# Altium project Minuterie_teluq.PrjPcb
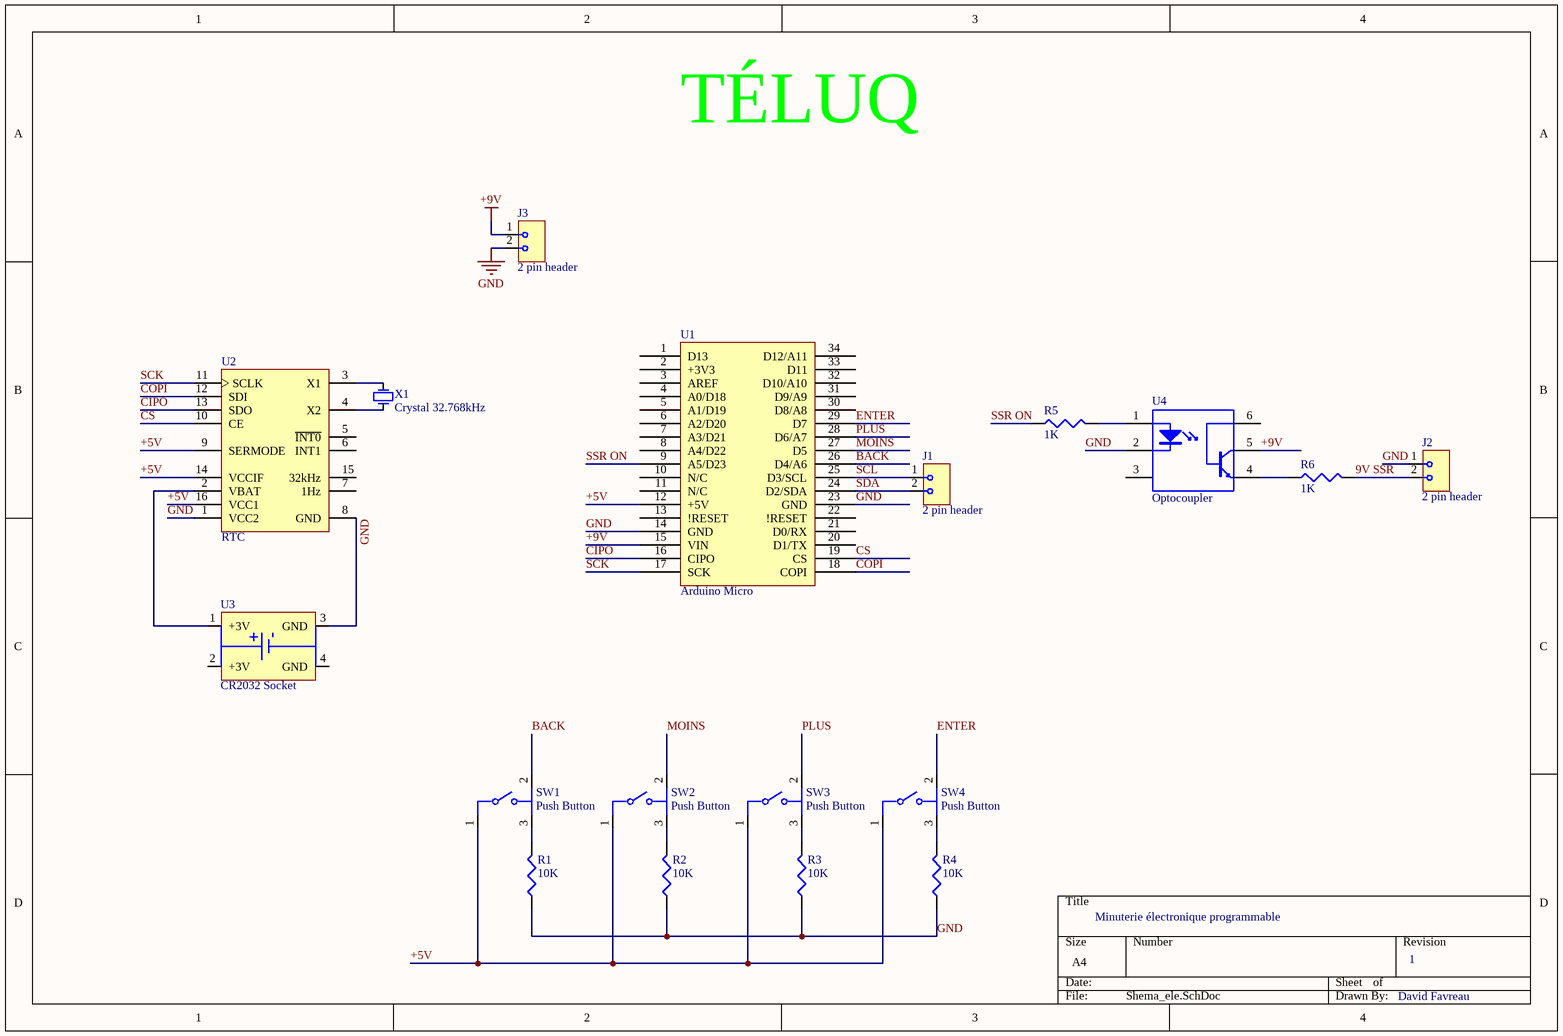
[diagram p0: Shema_ele.SchDoc]
1 sheet, 19 parts. Net scope: global (net labels, ports and power ports of the same name join across sheets).
Board file: PCB_Minuteire.PcbDoc

## Sheet Shema_ele.SchDoc
size A4; SheetNumber: 1; SheetTotal: 1

### Parts
*  Logo TELUQ  [Logo TELQUQ]  (value not drawn)
J1  2 pin header  [Dual header]
J2  2 pin header  [Dual header]
J3  2 pin header  [Dual header]
R1  10K  [Res_TH]
R2  10K  [Res_TH]
R3  10K  [Res_TH]
R4  10K  [Res_TH]
R5  1K  [Res_TH]
R6  1K  [Res_TH]
SW1  Push Button  [Push button]
SW2  Push Button  [Push button]
SW3  Push Button  [Push button]
SW4  Push Button  [Push button]
U1  Arduino Micro  [Micro-C]
U2  RTC  [DIP16]
U3  CR2032 Socket  [Battery socket]
U4  Optocoupler  [DIP6]
X1  Crystal 32.768kHz  [Crystal]

### Nets
+9V: J3.1 U1.15(VIN) U4.5(C)
GND: J2.1 J3.2 R1.1 R2.1 R3.1 R4.1 U1.14(GND) U1.23(GND) U2.1(VCC2) U2.8(GND) U3.3(GND) U4.2(C)
9V SSR: J2.2 R6.2
+5V: SW1.1 SW2.1 SW3.1 SW4.1 U1.12(+5V) U2.9(SERMODE) U2.14(VCCIF) U2.16(VCC1)
BACK: SW1.2 U1.26(D4/A6)
CIPO: U1.16(CIPO) U2.13(SDO)
COPI: U1.18(COPI) U2.12(SDI)
CS: U1.19(CS) U2.10(CE)
ENTER: SW4.2 U1.29(D7)
MOINS: SW2.2 U1.27(D5)
PLUS: SW3.2 U1.28(D6/A7)
SCK: U1.17(SCK) U2.11(SCLK)
SCL: J1.1 U1.25(D3/SCL)
SDA: J1.2 U1.24(D2/SDA)
SSR ON: R5.1 U1.9(A5/D23)
NetR1_2: R1.2 SW1.3
NetR2_2: R2.2 SW2.3
NetR3_2: R3.2 SW3.3
NetR4_2: R4.2 SW4.3
NetR5_2: R5.2 U4.1(A)
NetR6_1: R6.1 U4.4(E)
NetU2_2: U2.2(VBAT) U3.1(+3V)
NetU2_3: U2.3(X1) X1.2(X2)
NetU2_4: U2.4(X2) X1.1(X1)

Not connected (* = marked no-connect by the designer): U1 1(D13) 2(+3V3) 3(AREF) 4(A0/D18) 5(A1/D19) 6(A2/D20) 7(A3/D21) 8(A4/D22) 10(N/C) 11(N/C) 13(!RESET) 20(D1/TX) 21(D0/RX) 22(!RESET) 30(D8/A8) 31(D9/A9) 32(D10/A10) 33(D11) 34(D12/A11); U2 5(~{INT0}) 6(INT1) 7(1Hz) 15(32kHz); U3 2(+3V) 4(GND); U4 3(NC) 6(B)

### Notes on the sheet
- Minuterie électronique programmable
- 1
- David Favreau
- (in symbol Logo TELUQ) TÉLUQ

### Library data of the parts
J1-J3 = M20-9990246: 2.54mm (0.1") Pitch SIL Vertical PC Tail Pin Header, 6.1mm mating pin height, tin, 2 contacts; Manufacturer: Harwin; Max Current Rating: 3A; Number of Positions: 2; Gender: Male; Connector Type: Male Pin; Contact Resistance: 30mR; Insulation Resistance: 10GR; Voltage Rating (AC): 750V; Supplier 1: Digi-Key; Manufacturer Part Number: M20-9990246; RoHS: Yes; Category: Headers and Wire Housings; Stock 1: 37006; Pricing 1: 1=0.13000, 10=0.10300, 100=0.07610, 500=0.06300, 1000=0.05512, 5000=0.04725, 10000=0.04594 (USD); Mount: Through Hole; Case/Package: SIL; Contact Plating: Tin; Color: Black; Contact Material: Brass,Bronze; Housing Color: Black; Housing Material: Nylon; Min Operating Temperature: -40°C; Max Operating Temperature: 105°C; Number of Rows: 1; Package Quantity: 1000; Packaging: Bulk; Termination: Solder; Number of Contacts: 2; Orientation: Straight; Series: M20; Contact Type: Male Pin; Current Rating: 3A; Length: 5.08mm; Pitch: 2.54mm; Depth: 2.54mm; Contact Mating Length: 0.24inch; Radiation Hardening: No; REACH SVHC: No SVHC; ComponentLink1URL: https://datasheet.ciiva.com/22660/1830818-22660571.pdf?src-supplier=Element14; ComponentLink1Description: https://datasheet.ciiva.com/22660/1830818-22660571.pdf?src-supplier=Element14; ComponentLink2URL: https://datasheet.ciiva.com/11745/0900766b81034e61-11745755.pdf?src-supplier=RSComponents; ComponentLink2Description: https://datasheet.ciiva.com/11745/0900766b81034e61-11745755.pdf?src-supplier=RSComponents; ComponentLink3URL: https://datasheet.ciiva.com/8046/315376-8046930.pdf?src-supplier=Element14; ComponentLink3Description: https://datasheet.ciiva.com/8046/315376-8046930.pdf?src-supplier=Element14; ComponentLink4URL: https://datasheet.ciiva.com/6833/m20-999-6833368.pdf?src-supplier=Digi-Key; ComponentLink4Description: https://datasheet.ciiva.com/6833/m20-999-6833368.pdf?src-supplier=Digi-Key; ComponentLink5URL: https://datasheet.ciiva.com/26852/getdatasheetpartid-384170-26852203.pdf?src-supplier=Verical; ComponentLink5Description: https://datasheet.ciiva.com/26852/getdatasheetpartid-384170-26852203.pdf?src-supplier=Verical; Supplier Part Number 1: 952-2262-ND
R1-R4 = MFR-25FRF52-10K: Res Metal Film 10K Ohm 1% 1/4W ±100ppm/°C Conformal Axial Thru-Hole T/R; Manufacturer: Yageo; Resistance: 10kR; Power Rating: 250mW; Voltage Rating: 250V; Voltage Rating (DC): 200V; Lead Diameter: 0.6mm; Supplier 1: Digi-Key; Manufacturer Part Number: MFR-25FRF52-10K; RoHS: Yes; Category: Through-Hole Resistors; Stock 1: 345000; Pricing 1: 5000=0.01047, 10000=0.00939, 25000=0.00862, 50000=0.00819 (USD); Case/Package: Axial; Min Operating Temperature: -55°C; Max Operating Temperature: 155°C; Packaging: Tape and Reel; Package Quantity: 5000; Tolerance: 1%; Resistor Type: Metal Film; Termination: Axial; Number of Terminations: 2; Temperature Coefficient: 100ppm/°C; Max Power Dissipation: 250mW; Series: MFR; Length: 0.248inch; Width: 6.3mm; Lead Free: Lead Free; RoHS Compliant: Yes; ComponentLink1URL: https://datasheet.ciiva.com/25645/yageolr-mfr-2013-25645549.pdf?src-supplier=Digi-Key; ComponentLink1Description: https://datasheet.ciiva.com/25645/yageolr-mfr-2013-25645549.pdf?src-supplier=Digi-Key; Supplier Part Number 1: 10.0KXTR-ND
R5 R6 = MFR-25FRF52-1K: Res Metal Film 1K Ohm 1% 0.25W(1/4W) ±100ppm/C AXL Automotive T/R; Manufacturer: Yageo; Resistance: 1kR; Power Rating: 250mW; Voltage Rating: 250V; Temperature Coefficient: 100ppm/°C; Voltage Rating (DC): 200V; Lead Diameter: 0.6mm; Supplier 1: Digi-Key; Manufacturer Part Number: MFR-25FRF52-1K; RoHS: Yes; Category: Through-Hole Resistors; Stock 1: 95000; Pricing 1: 5000=0.01047, 10000=0.00939, 25000=0.00862, 50000=0.00819 (USD); Mount: Through Hole; Case/Package: Axial; Min Operating Temperature: -55°C; Max Operating Temperature: 155°C; Packaging: Tape and Reel; Tolerance: 1%; Termination: Axial; Package Quantity: 5000; Resistor Type: Metal Film; Number of Terminations: 2; Max Power Dissipation: 250mW; Series: MFR; Length: 0.248inch; Width: 6.3mm; RoHS Compliant: Yes; Lead Free: Lead Free; ComponentLink1URL: https://datasheet.ciiva.com/25645/yageolr-mfr-2013-25645548.pdf?src-supplier=Digi-Key; ComponentLink1Description: https://datasheet.ciiva.com/25645/yageolr-mfr-2013-25645548.pdf?src-supplier=Digi-Key; Supplier Part Number 1: 1.00KXTR-ND
SW1-SW4 = FSM103: Switch Tactile OFF (ON) SPST Round Button PC Pins 0.05A 24VDC 1.57N Thru-Hole Loose; Manufacturer: TE Connectivity Alcoswitch; Mechanical Life: 100000Cycles; Actuator Color: Black; Actuator Material: Polyester; Current Rating: 50mA; Voltage Rating (DC): 12V; Illumination Type: Non-Illuminated; Switch Travel: 0.3mm; Switch Function: Off-Mom; Contact Resistance: 100mR; Voltage Rating: 24V; Actuator Length: 3.4mm; Supplier 1: Digi-Key; Manufacturer Part Number: FSM103; RoHS: Yes; Category: Uncategorized; Stock 1: 1345; Pricing 1: 1=0.38000, 10=0.36900, 25=0.34720, 100=0.30150, 250=0.27348, 500=0.25440, 1000=0.22896, 2500=0.21497, 5000=0.19970 (USD); Mount: Through Hole; Contact Material: Brass; Contact Plating: Silver; Min Operating Temperature: -35°C; Max Operating Temperature: 85°C; Packaging: Loose Piece; Operating Force: 1.57N; Package Quantity: 400; Throw Configuration: SPST; Termination: PC Pins; Max Voltage Rating (DC): 12V; Series: FSM100 ~ 104; Contact Current Rating: 50mA; Orientation: Straight; Max Current Rating: 50mA; Electrical Life: 100000Cycles; Type: Switch; Length: 12mm; Width: 12mm; Depth: 14.1mm; Radiation Hardening: No; RoHS Compliant: Yes; REACH SVHC: Unknown; ComponentLink1URL: https://datasheet.ciiva.com/8661/eng-cd-1437565-5-d-8661873.pdf?src-supplier=Avnet; ComponentLink1Description: https://datasheet.ciiva.com/8661/eng-cd-1437565-5-d-8661873.pdf?src-supplier=Avnet; ComponentLink2URL: https://datasheet.ciiva.com/2899/eng-cd-1437565-5-e2-2899955.pdf?src-supplier=Digi-Key; ComponentLink2Description: https://datasheet.ciiva.com/2899/eng-cd-1437565-5-e2-2899955.pdf?src-supplier=Digi-Key; ComponentLink3URL: https://datasheet.ciiva.com/5809/eng-cd-1437565-5-e2-5809302.pdf?src-supplier=Farnell; ComponentLink3Description: https://datasheet.ciiva.com/5809/eng-cd-1437565-5-e2-5809302.pdf?src-supplier=Farnell; ComponentLink4URL: https://datasheet.ciiva.com/16534/eng-cd-1437565-5-d-16534933.pdf?src-supplier=Avnet+Europe; ComponentLink4Description: https://datasheet.ciiva.com/16534/eng-cd-1437565-5-d-16534933.pdf?src-supplier=Avnet+Europe; ComponentLink5URL: https://datasheet.ciiva.com/31838/eng-cat-1308390-0904-e15-e25-31838910.pdf?src-supplier=Onlinecomponents.com; ComponentLink5Description: https://datasheet.ciiva.com/31838/eng-cat-1308390-0904-e15-e25-31838910.pdf?src-supplier=Onlinecomponents.com; ComponentLink6URL: https://datasheet.ciiva.com/7635/921681-7635435.pdf?src-supplier=Element14; ComponentLink6Description: https://datasheet.ciiva.com/7635/921681-7635435.pdf?src-supplier=Element14; Supplier Part Number 1: 450-1158-ND
U1 = A000053: ATmega32u4 Microcontroller Micro Development Board 16MHz CPU 2.5KB RAM 1KB/32KB EEPROM/Flash; Core Architecture: AVR; Evaluation Kit: Yes; Number of Bits: 8; Interface: USB; Data Bus Width: 8b; Operating Supply Voltage: 5V; Supplier 1: Digi-Key; Manufacturer: Arduino; Manufacturer Part Number: A000053; RoHS: Yes; Category: Embedded Processors and Controllers; Stock 1: 535; Pricing 1: 1=20.70000 (USD); Weight: 0.02lb; Package Quantity: 1; Series: AVR® ATmega; Length: 2inch; Width: 1inch; Height: 0.05inch; REACH SVHC: Unknown; ComponentLink1URL: https://datasheet.ciiva.com/29354/a000053-web-29354346.pdf?src-supplier=Digi-Key; ComponentLink1Description: https://datasheet.ciiva.com/29354/a000053-web-29354346.pdf?src-supplier=Digi-Key; ComponentLink2URL: https://datasheet.ciiva.com/20168/73-4614-20168561.pdf?src-supplier=Rapid+Electronics; ComponentLink2Description: https://datasheet.ciiva.com/20168/73-4614-20168561.pdf?src-supplier=Rapid+Electronics; ComponentLink3URL: https://datasheet.ciiva.com/27059/2207700-27059801.pdf?src-supplier=Jameco; ComponentLink3Description: https://datasheet.ciiva.com/27059/2207700-27059801.pdf?src-supplier=Jameco; ComponentLink4URL: https://datasheet.ciiva.com/22632/1685581-22632353.pdf?src-supplier=Element14; ComponentLink4Description: https://datasheet.ciiva.com/22632/1685581-22632353.pdf?src-supplier=Element14; ComponentLink5URL: https://datasheet.ciiva.com/14175/micro-eng-tds-14175737.pdf?src-supplier=Distrelec; ComponentLink5Description: https://datasheet.ciiva.com/14175/micro-eng-tds-14175737.pdf?src-supplier=Distrelec; ComponentLink6URL: https://datasheet.ciiva.com/25630/0900766b8119187a-25630646.pdf?src-supplier=RSComponents; ComponentLink6Description: https://datasheet.ciiva.com/25630/0900766b8119187a-25630646.pdf?src-supplier=RSComponents; Supplier Part Number 1: 1050-1066-ND
U2 = DS1306N+: DS1306 Series 2 to 5.5 V 96B Battery-Backed NV RAM Serial Alarm RTC - DIP-16; Manufacturer: Maxim; Time Format: HH:MM:SS; Interface: SPI; Logic Function: Clock; Date Format: YY-MM-DD-dd; Max Supply Voltage: 5.5V; Min Supply Voltage: 2V; Supplier 1: Newark; Manufacturer Part Number: DS1306N+; RoHS: Yes; Category: Real Time Clocks; Stock 1: 3; Pricing 1: 1=7.69000, 10=6.94000, 25=6.62000, 50=6.19000, 100=5.75000, 250=5.49000 (USD); Mount: Through Hole; Case/Package: DIP; Number of Pins: 16; Min Operating Temperature: 0°C; Max Operating Temperature: 70°C; Package Quantity: 25; Packaging: Rail/Tube; Memory Size: 96B; Series: -; Length: 19.43mm; Width: 7.87mm; Height: 4.45mm; Radiation Hardening: No; Lead Free: Lead Free; RoHS Compliant: Yes; REACH SVHC: Unknown; ComponentLink1URL: https://datasheet.ciiva.com/26795/ds1306n-26795569.pdf?src-supplier=IIIC; ComponentLink1Description: https://datasheet.ciiva.com/26795/ds1306n-26795569.pdf?src-supplier=IIIC; ComponentLink2URL: https://datasheet.ciiva.com/3304/ds1306-3304455.pdf?src-supplier=Avnet; ComponentLink2Description: https://datasheet.ciiva.com/3304/ds1306-3304455.pdf?src-supplier=Avnet; ComponentLink3URL: https://datasheet.ciiva.com/1240/ds1306-1240611.pdf?src-supplier=Digi-Key; ComponentLink3Description: https://datasheet.ciiva.com/1240/ds1306-1240611.pdf?src-supplier=Digi-Key; Supplier Part Number 1: 73Y1205
U3 = 1870: Heyco RDD Lockit Strain Relief Bushings Straight-Thru RDD 101A BLACK; Manufacturer: Adafruit Industries; Supplier 1: Digi-Key; Manufacturer Part Number: 1870; RoHS: Yes; Category: Connectors; Stock 1: 500; Pricing 1: 1=2.50000 (USD); Supplier Part Number 1: 1528-2012-ND
U4 = 4N35: Single Channel 80 V 5000 Vrms Phototransistor Optocoupler Through Hole - DIP-6; Manufacturer: Vishay; Max Power Dissipation: 70mW; Number of Channels: 1; Isolation Voltage: 5kV; Output Voltage: 30V; Forward Voltage: 1.5V; Collector Emitter Voltage (VCEO): 70V; Max Input Current: 60mA; Reverse Breakdown Voltage: 6V; Forward Current: 50mA; Collector Emitter Saturation Voltage: 300mV; Rise Time: 3us; Input Current: 10mA; Input Type: DC; Isolation Voltage-Max: 5.3kV; Current Transfer Ratio: 50%; Output Current per Channel: 100mA; Approvals: UL,BSI,FIMKO; Supplier 1: Digi-Key; Manufacturer Part Number: 4N35; RoHS: Yes; Category: Optocouplers; Stock 1: 2871; Pricing 1: 1=0.55000, 10=0.47300, 100=0.35320, 500=0.27750, 1000=0.21444, 2000=0.19552, 5000=0.18290, 10000=0.17850 (USD); Mount: Through Hole; Case/Package: DIP; Number of Pins: 6; Min Operating Temperature: -55°C; Max Operating Temperature: 100°C; Packaging: Rail/Tube; Package Quantity: 2000; Power Dissipation: 70mW; Max Output Voltage: 30V; Number of Elements: 1; Series: -; Number of Circuits: 1; Collector-emitter Voltage-Max: 300mV; Max Collector Current: 100mA; Collector Emitter Breakdown Voltage: 30V; Reverse Voltage (DC): 6V; Radiation Hardening: No; Lead Free: Lead Free; RoHS Compliant: Yes; REACH SVHC: Unknown; ComponentLink1URL: https://datasheet.ciiva.com/1247/1693303-1247044.pdf?src-supplier=Element14; ComponentLink1Description: https://datasheet.ciiva.com/1247/1693303-1247044.pdf?src-supplier=Element14; ComponentLink2URL: https://datasheet.ciiva.com/26321/60647-26321011.pdf?src-supplier=Element14; ComponentLink2Description: https://datasheet.ciiva.com/26321/60647-26321011.pdf?src-supplier=Element14; ComponentLink3URL: https://datasheet.ciiva.com/15118/getdatasheetpartid-89490-15118529.pdf?src-supplier=Verical; ComponentLink3Description: https://datasheet.ciiva.com/15118/getdatasheetpartid-89490-15118529.pdf?src-supplier=Verical; ComponentLink4URL: https://datasheet.ciiva.com/11771/0900766b80dca9c8-11771779.pdf?src-supplier=RSComponents; ComponentLink4Description: https://datasheet.ciiva.com/11771/0900766b80dca9c8-11771779.pdf?src-supplier=RSComponents; ComponentLink5URL: https://datasheet.ciiva.com/29301/152890-da-01-en-optocoupler-4n35-29301371.pdf?src-supplier=Conrad; ComponentLink5Description: https://datasheet.ciiva.com/29301/152890-da-01-en-optocoupler-4n35-29301371.pdf?src-supplier=Conrad; ComponentLink6URL: https://datasheet.ciiva.com/2086/s-110-4n354n37m-s-s-ta1rev-2086319.pdf?src-supplier=Digi-Key; ComponentLink6Description: https://datasheet.ciiva.com/2086/s-110-4n354n37m-s-s-ta1rev-2086319.pdf?src-supplier=Digi-Key; ComponentLink7URL: https://datasheet.ciiva.com/14105/4n35-7-eng-tds-14105851.pdf?src-supplier=Distrelec; ComponentLink7Description: https://datasheet.ciiva.com/14105/4n35-7-eng-tds-14105851.pdf?src-supplier=Distrelec; ComponentLink8URL: https://datasheet.ciiva.com/3305/4n35-3305941.pdf?src-supplier=Avnet; ComponentLink8Description: https://datasheet.ciiva.com/3305/4n35-3305941.pdf?src-supplier=Avnet; ComponentLink9URL: https://datasheet.ciiva.com/16317/4n35-16317882.pdf?src-supplier=Future+Electronics; ComponentLink9Description: https://datasheet.ciiva.com/16317/4n35-16317882.pdf?src-supplier=Future+Electronics; ComponentLink10URL: https://datasheet.ciiva.com/25900/4n35-25900614.pdf?src-supplier=Avnet+Europe; ComponentLink10Description: https://datasheet.ciiva.com/25900/4n35-25900614.pdf?src-supplier=Avnet+Europe; ComponentLink11URL: https://datasheet.ciiva.com/2087/4n35-2087114.pdf?src-supplier=Digi-Key; ComponentLink11Description: https://datasheet.ciiva.com/2087/4n35-2087114.pdf?src-supplier=Digi-Key; ComponentLink12URL: https://datasheet.ciiva.com/1333/1533488-1333901.pdf?src-supplier=Newark; ComponentLink12Description: https://datasheet.ciiva.com/1333/1533488-1333901.pdf?src-supplier=Newark
X1 = CFS-20632768DZBB: Crystal 0.032768MHz ±20ppm (Tol) 6pF Flexural 35000Ohm 2-Pin Thru-Hole Bulk; Manufacturer: Citizen; ESR (Equivalent Series Resistance): 35kR; Supplier 1: Digi-Key; Manufacturer Part Number: CFS-20632768DZBB; RoHS: Yes; Category: Crystals; Stock 1: 136913; Pricing 1: 1=0.26000, 10=0.22000, 50=0.19800, 100=0.17600, 500=0.16720, 1000=0.14080, 2500=0.13200, 5000=0.12760, 10000=0.12320 (USD); Mount: Through Hole; Case/Package: Radial; Min Operating Temperature: -20°C; Max Operating Temperature: 70°C; Load Capacitance: 6pF; Packaging: Bulk; Frequency: 32.768kHz; Frequency Tolerance: 20ppm; Lead Free: Lead Free; RoHS Compliant: Yes; ComponentLink1URL: http://cfd.citizen.co.jp/english/prod-tech/product/pdf/datasheet_TF/CFS-206_CFS-145_E.pdf?src-supplier=Digi-Key; ComponentLink1Description: http://cfd.citizen.co.jp/english/prod-tech/product/pdf/datasheet_TF/CFS-206_CFS-145_E.pdf?src-supplier=Digi-Key; Supplier Part Number 1: 300-8301-ND